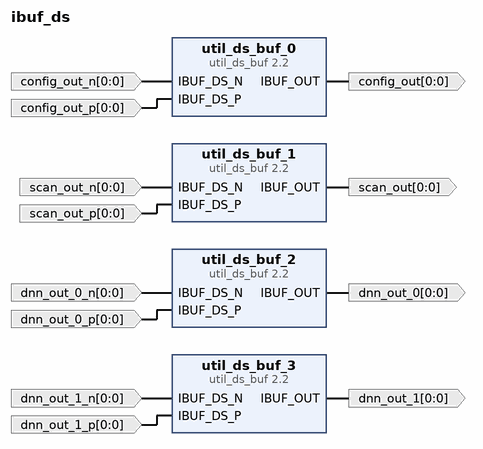
[diagram p0: block diagram of the top level]
# Vivado block design ibuf_ds, xczu9eg-ffvb1156-2-e, Vivado 2022.1
create_bd_design ibuf_ds

create_bd_port -dir I -from 0 -to 0 -type data config_out_p
create_bd_port -dir I -from 0 -to 0 -type data config_out_n
create_bd_port -dir O -from 0 -to 0 -type data config_out
create_bd_port -dir I -from 0 -to 0 -type data scan_out_p
create_bd_port -dir I -from 0 -to 0 -type data scan_out_n
create_bd_port -dir O -from 0 -to 0 -type data scan_out
create_bd_port -dir I -from 0 -to 0 -type data dnn_out_0_p
create_bd_port -dir I -from 0 -to 0 -type data dnn_out_0_n
create_bd_port -dir O -from 0 -to 0 -type data dnn_out_0
create_bd_port -dir I -from 0 -to 0 -type data dnn_out_1_p
create_bd_port -dir I -from 0 -to 0 -type data dnn_out_1_n
create_bd_port -dir O -from 0 -to 0 -type data dnn_out_1

create_bd_cell -type ip -vlnv xilinx.com:ip:util_ds_buf:2.2 util_ds_buf_0
create_bd_cell -type ip -vlnv xilinx.com:ip:util_ds_buf:2.2 util_ds_buf_1
create_bd_cell -type ip -vlnv xilinx.com:ip:util_ds_buf:2.2 util_ds_buf_2
create_bd_cell -type ip -vlnv xilinx.com:ip:util_ds_buf:2.2 util_ds_buf_3

# ---- connections ----

connect_bd_net [get_bd_ports config_out_n] [get_bd_pins util_ds_buf_0/IBUF_DS_N]
connect_bd_net [get_bd_ports config_out_p] [get_bd_pins util_ds_buf_0/IBUF_DS_P]
connect_bd_net [get_bd_ports dnn_out_0_n] [get_bd_pins util_ds_buf_2/IBUF_DS_N]
connect_bd_net [get_bd_ports dnn_out_0_p] [get_bd_pins util_ds_buf_2/IBUF_DS_P]
connect_bd_net [get_bd_ports dnn_out_1_n] [get_bd_pins util_ds_buf_3/IBUF_DS_N]
connect_bd_net [get_bd_ports dnn_out_1_p] [get_bd_pins util_ds_buf_3/IBUF_DS_P]
connect_bd_net [get_bd_ports scan_out_n] [get_bd_pins util_ds_buf_1/IBUF_DS_N]
connect_bd_net [get_bd_ports scan_out_p] [get_bd_pins util_ds_buf_1/IBUF_DS_P]
connect_bd_net [get_bd_pins util_ds_buf_0/IBUF_OUT] [get_bd_ports config_out]
connect_bd_net [get_bd_pins util_ds_buf_1/IBUF_OUT] [get_bd_ports scan_out]
connect_bd_net [get_bd_pins util_ds_buf_2/IBUF_OUT] [get_bd_ports dnn_out_0]
connect_bd_net [get_bd_pins util_ds_buf_3/IBUF_OUT] [get_bd_ports dnn_out_1]

validate_bd_design
save_bd_design
